# Altium project hv-distribution-board.PrjPcb
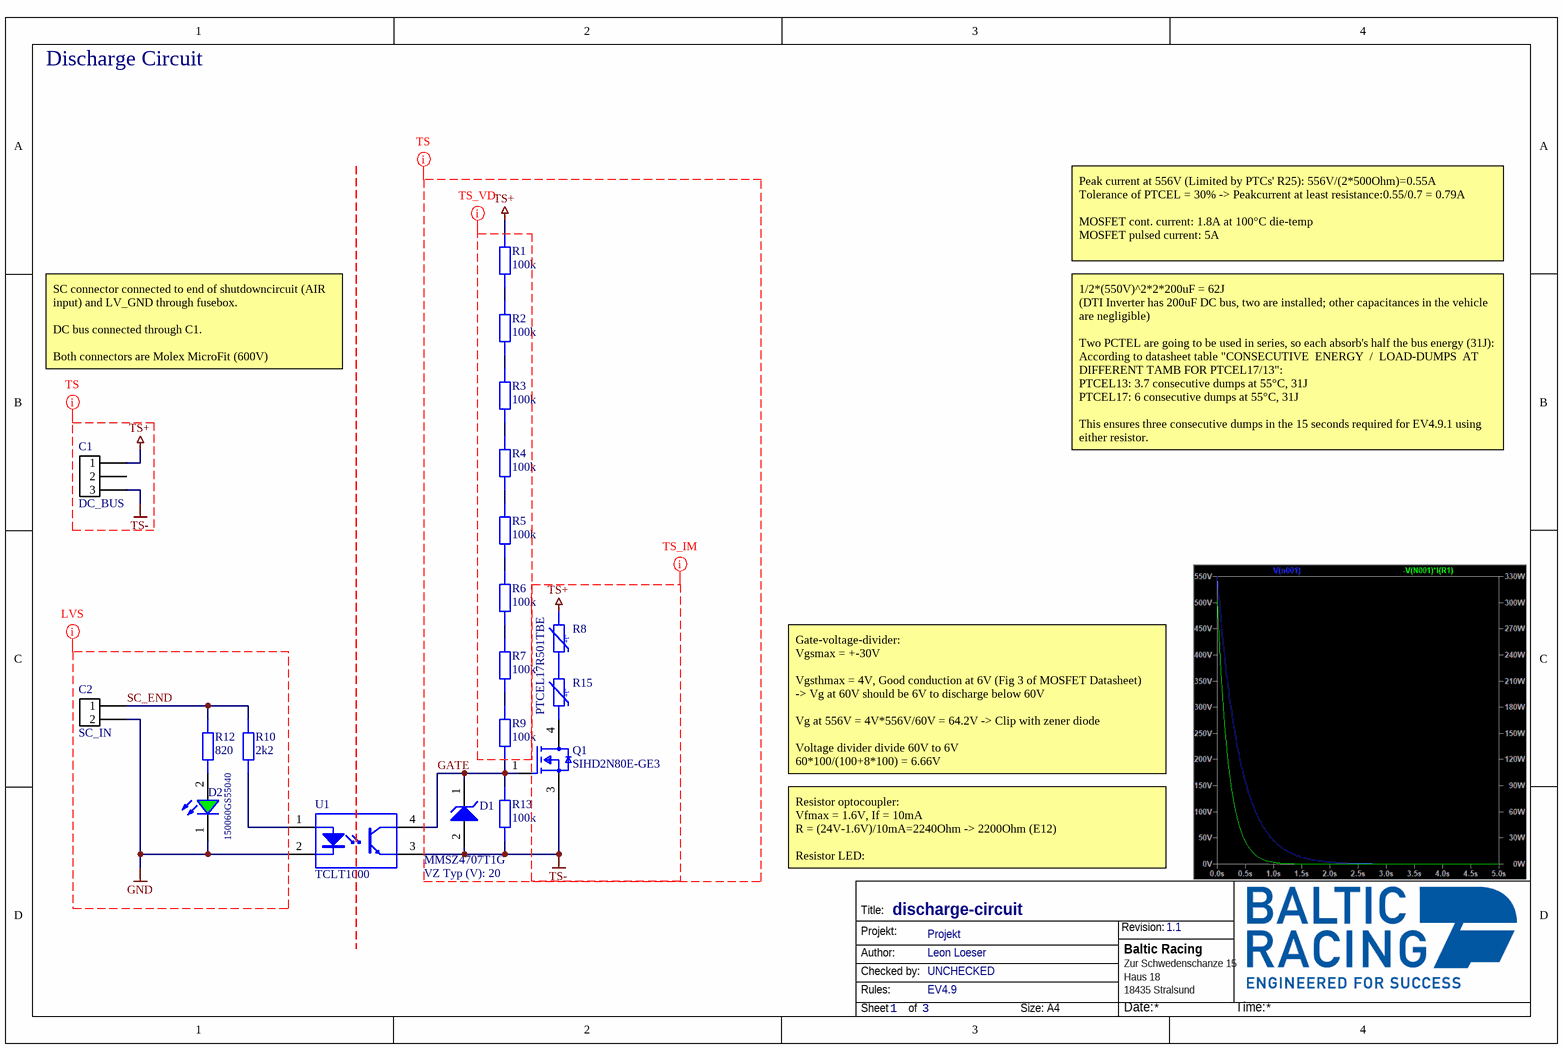
[diagram p0: discharge-circuit.SchDoc]
BoardName: hv-distribution-board; BoardRevision: 1.1; Organization: Baltic Racing
3 sheets, 28 parts. Net scope: global (net labels, ports and power ports of the same name join across sheets).
Board file: hv-distribution-board.PcbDoc
Sheets:
  discharge-circuit.SchDoc
  voltage-detection.SchDoc
  tsmp-resistors.SchDoc

## Sheet discharge-circuit.SchDoc: discharge-circuit
size A4; Date: 05.10.2017; CheckedBy: UNCHECKED; Author: Leon Loeser; Organization: Baltic Racing; Address1: Zur Schwedenschanze 15; Address2: Haus 18; Address3: 18435 Stralsund; Revision: 1.1; SheetNumber: 1; SheetTotal: 3; Rules: EV4.9; ProjectName: Projekt

### Parts
C1  DC_BUS  [43650-0309]
C2  SC_IN  [43650-0200]
D1  MMSZ4707T1G  VZ Typ (V): 20  [ONSC-SOD-123-2-425-04_V]
D2  150060GS55040  [WL-SMCW_0603_H=0.7]
Q1  SIHD2N80E-GE3  [FP-T16-0236-MFG]
R1  value 100k  [STACKPOLE CSR1206]  (hidden comment: SMD Resistor)
R2  value 100k  [STACKPOLE CSR1206]  (hidden comment: SMD Resistor)
R3  value 100k  [STACKPOLE CSR1206]  (hidden comment: SMD Resistor)
R4  value 100k  [STACKPOLE CSR1206]  (hidden comment: SMD Resistor)
R5  value 100k  [STACKPOLE CSR1206]  (hidden comment: SMD Resistor)
R6  value 100k  [STACKPOLE CSR1206]  (hidden comment: SMD Resistor)
R7  value 100k  [STACKPOLE CSR1206]  (hidden comment: SMD Resistor)
R8  PTCEL17R501TBE  [PTCEL17]  (value not drawn)
R9  value 100k  [STACKPOLE CSR1206]  (hidden comment: SMD Resistor)
R10  value 2k2  [STACKPOLE CSR0603]  (hidden comment: SMD Resistor)
R12  value 820  [STACKPOLE CSR0603]  (hidden comment: SMD Resistor)
R13  value 100k  [STACKPOLE CSR0603]  (hidden comment: SMD Resistor)
R15  PTCEL17R501TBE  [PTCEL17]
U1  TCLT1000  [VISH-SOP4L-4_V]

### Nets
GND: C2.2 D2.1(K) U1.2(C)
TS+: C1.1 R1.2 R8.1
TS-: C1.3 D1.2(A) Q1.3(S) R13.1 U1.3(E)
GATE: D1.1(K) Q1.1(G) R9.1 R13.2 U1.4(C)
SC_END: C2.1 R10.1 R12.2
NetD2_2: D2.2(A) R12.1
NetQ1_4: Q1.4(D) R15.2
NetR1_1: R1.1 R2.2
NetR2_1: R2.1 R3.2
NetR3_1: R3.1 R4.2
NetR4_1: R4.1 R5.2
NetR5_1: R5.1 R6.2
NetR6_1: R6.1 R7.2
NetR7_1: R7.1 R9.2
NetR8_2: R8.2 R15.1
NetR10_2: R10.2 U1.1(A)

Not connected (* = marked no-connect by the designer): C1 2

### Layout directives
net class TS: GATE, TS+, TS-
net class GLVS: GND, SC_END
net class TS_IM: GATE, TS+, TS-
net class TS_VD: GATE, TS+, TS-

### Notes on the sheet
- Discharge Circuit
- Peak current at 556V (Limited by PTCs' R25): 556V/(2*500Ohm)=0.55A
  Tolerance of PTCEL = 30% -> Peakcurrent at least resistance:0.55/0.7 = 0.79A
  MOSFET cont. current: 1.8A at 100°C die-temp
  MOSFET pulsed current: 5A
- SC connector connected to end of shutdowncircuit (AIR input) and LV_GND through fusebox.
  DC bus connected through C1.
  Both connectors are Molex MicroFit (600V)
- 1/2*(550V)^2*2*200uF = 62J
  (DTI Inverter has 200uF DC bus, two are installed; other capacitances in the vehicle are negligible)
  Two PCTEL are going to be used in series, so each absorb's half the bus energy (31J):
  According to datasheet table "CONSECUTIVE  ENERGY  /  LOAD-DUMPS  AT DIFFERENT TAMB FOR PTCEL17/13":
  PTCEL13: 3.7 consecutive dumps at 55°C, 31J
  PTCEL17: 6 consecutive dumps at 55°C, 31J
  This ensures three consecutive dumps in the 15 seconds required for EV4.9.1 using either resistor.
- Gate-voltage-divider:
  Vgsmax = +-30V
  Vgsthmax = 4V, Good conduction at 6V (Fig 3 of MOSFET Datasheet)
  -> Vg at 60V should be 6V to discharge below 60V
  Vg at 556V = 4V*556V/60V = 64.2V -> Clip with zener diode
  Voltage divider divide 60V to 6V
  60*100/(100+8*100) = 6.66V
- Resistor optocoupler:
  Vfmax = 1.6V, If = 10mA
  R = (24V-1.6V)/10mA=2240Ohm -> 2200Ohm (E12)
  Resistor LED:
  Vfmax = 3.4V, If = 25mA
  R = (24V-3.4V)/25mA=832Ohm -> 820Ohm (E12)
- Title:
- Projekt:
- Revision:
- Author:
- Rules:
- Checked by:
- Sheet
- of
- Size:
- A4
- Date:
- Time:
- (in symbol PTCEL17R501TBE) +t°

### Library data of the parts
C1 = MicroFit3.0 3-Pin: Molex Micro-Fit 3.0 3-Pin / 600V / 8.5A
C2 = MicroFit3.0 2-Pin: Molex Micro-Fit 3.0 2-Pin / 600V / 8.5A
D1 = CMP-1060-00328-1: Zener Voltage Regulator, 500 mW, 2-Pin SOD-123, Pb-Free, Tape and Reel; Manufacturer: On Semiconductor; P Max (W): 0.5; ComponentLink2Description: Datasheet; ComponentLink1Description: Manufacturer URL; PackageReference: SOD-123-2-425-04; PackageVersion: Rev. G, 10/2009; DatasheetVersion: Rev. 9; ComponentLink3URL: http://www.onsemi.com/pub_link/Collateral/425-04.PDF; ComponentLink2URL: http://www.onsemi.com/pub_link/Collateral/MMSZ4678T1-D.PDF; PackageDescription: 2-Pin SOD, Body 1.6 x 2.69 mm; Mounting Technology: Surface Mount; Packing: Tape and Reel; ComponentLink1URL: http://www.onsemi.com/; PartNumber: MMSZ4707T1G; ComponentLink3Description: Package Specification; RoHS: Pb-Free
D2 = 150060GS75000: SMT Mono-color Chip LED Waterclear WL-SMCW, size 0603, Green, 3.2 V, 140 deg, 430 mcd; Forward Voltage: 3.2 V; Viewing Angle: 140 deg; Peak Wavelength: 515 nm; Dominant Wavelength: 525 nm; Luminous Intensity: 430 mcd; Chip Technology: InGaN; ComponentLink1Description: Manufacturer; ComponentLink1URL: http://www.we-online.de; ComponentLink2Description: Datasheet; ComponentLink2URL: https://katalog.we-online.de/led/datasheet/150060GS75000.pdf; Part Number: 150060GS75000; Published Date: November 2018; Publisher: Wurth Elektronik; Size: 0603; Operating Temperature: -40 to 85 degC; Emitting Color: Green; Mounting Technology: SMT; Packaging: Tape and Reel
Q1 = CMP-02550-000080-1: MOSFET N-CH 800V 2.8A DPAK; Manufacturer: Vishay; Drain To Source Resistance: 2.38Ω; Reverse Recovery Time: 278ns; Power Dissipation: 62.5W; Reverse Recovery Charge: 900nC; Input Capacitace At Vds: 315pF @ 100V; Number Of Channels: 1; Turn On Delay Time: 11ns; Threshold Vgs Max: 4V; Threshold Vgs Min: 2V; Rthja Max: 62°C/W; Turn Off Delay Time: 19ns; Transconductance: 1S; Depletion Mode: False; Gate Charge At Vgs: 9.8nC @ 10V; Max Forward Diode Voltage: 1.2V; Gate To Source Voltage: 30V; Max Junction Temp: +150°C; Pulse Drain Current: 5A; Drain To Source Voltage: 800V; Lead Free: Yes; Continuous Drain Current: 2.8A; Category: Trans; Temperature Range Low: -55°C; Octopart: https://octopart.com/sihd2n80e-ge3-vishay-84840963; Device Class L3: MOSFETs; Manufacturer Part Number: SIHD2N80E-GE3; Footprint Url: https://www.vishay.com/docs/72594/72594.pdf; ComponentLink2URL: https://www.vishay.com/docs/91987/sihd2n80e.pdf; Device Class L1: Discrete Semiconductors; ComponentLink2Description: Datasheet; Digikey Description: MOSFET N-CH 800V 2.8A DPAK; Temperature: -55°C to +150°C; Device Class L2: Transistors; Number Of N Channels: 1; Height: 2.507mm; Drain To Source Breakdown Voltage: 800V; Automotive: No; RoHS: TRUE; Temperature Range High: +150°C; Package: T16-0236
R1-R7 R9 R10 R12 R13 = SMD Resistor: Resistor with multiple footprints
R8 R15 = PTCEL17R501TBE: PTCEL Series 1000 V 500 Ohm ±30 % Radial Inrush Current Limiter PTC Thermistor; Manufacturer: Vishay BCcomponents; Tolerance: 30%; Supplier 1: Mouser; Manufacturer Part Number: PTCEL17R501TBE; RoHS: No; Stock 1: 130; Pricing 1: 1=3,37000, 5=3,30000, 10=3,15000, 25=3,00000, 50=2,70000, 100=2,55000, 200=2,46000, 500=2,25000, 1000=2,17000, 10000=2,17000 (USD); RoHS Compliant: No; ComponentLink1URL: http://www.vishay.com/docs/29165/ptcel.pdf?src-supplier=Digi-Key; ComponentLink1Description: http://www.vishay.com/docs/29165/ptcel.pdf?src-supplier=Digi-Key; Supplier Part Number 1: 594-PTCEL17R501TBE
U1 = CMP-2000-07234-1: Optocoupler, Phototransistor Output, VCEO 70 V, -55 to 100 degC, 4-Pin SOP (SOP4L), RoHS, Tape and Reel; Manufacturer: Vishay/Semiconductor; Maximum Collector Emitter Voltage: 70V; Input Type: DC; Maximum Reverse Voltage: 6V; Maximum Collector Emitter Saturation Voltage: 300mV; Number of Channels per Chip: 1; Maximum Collector Current: 50mA; Maximum Power Dissipation: 250mW; Maximum Forward Voltage: 1.6V; Maximum Input Current: 60mA; Typical Forward Voltage: 1.25V; Minimum Isolation Voltage: 5000Vrms; Maximum Current Transfer Ratio @ Current: 600%; Manufacturer URL: http://www.vishay.com/; Package: 4SOP; Mounting Technology: SurfaceMount; Category: TransistorandPhotovoltaicOutputPhotoCouplers; Datasheet URL: http://www.vishay.com/docs/83515/tclt1000.pdf; Output Type: DC; Operating Temperature: -40to100°C; Package Description: 4-Pin Small Outline Package Integrated Circuit, Body 4.1 x 7.5 mm, Pitch 2.54 mm; Datasheet Version: Rev. 2.9, 12/2015; Package Reference: SOP4L; Packaging: Tape&Reel

## Sheet voltage-detection.SchDoc: voltage-detection
size A4; CheckedBy: Nico Bieberich; Author: Leon Loeser; Organization: Baltic Racing; Address1: Zur Schwedenschanze 15; Address2: Haus 18; Address3: 18435 Stralsund; Revision: 1.1; SheetNumber: 2; SheetTotal: 3; Rules: EV4.10.2; ProjectName: Projekt
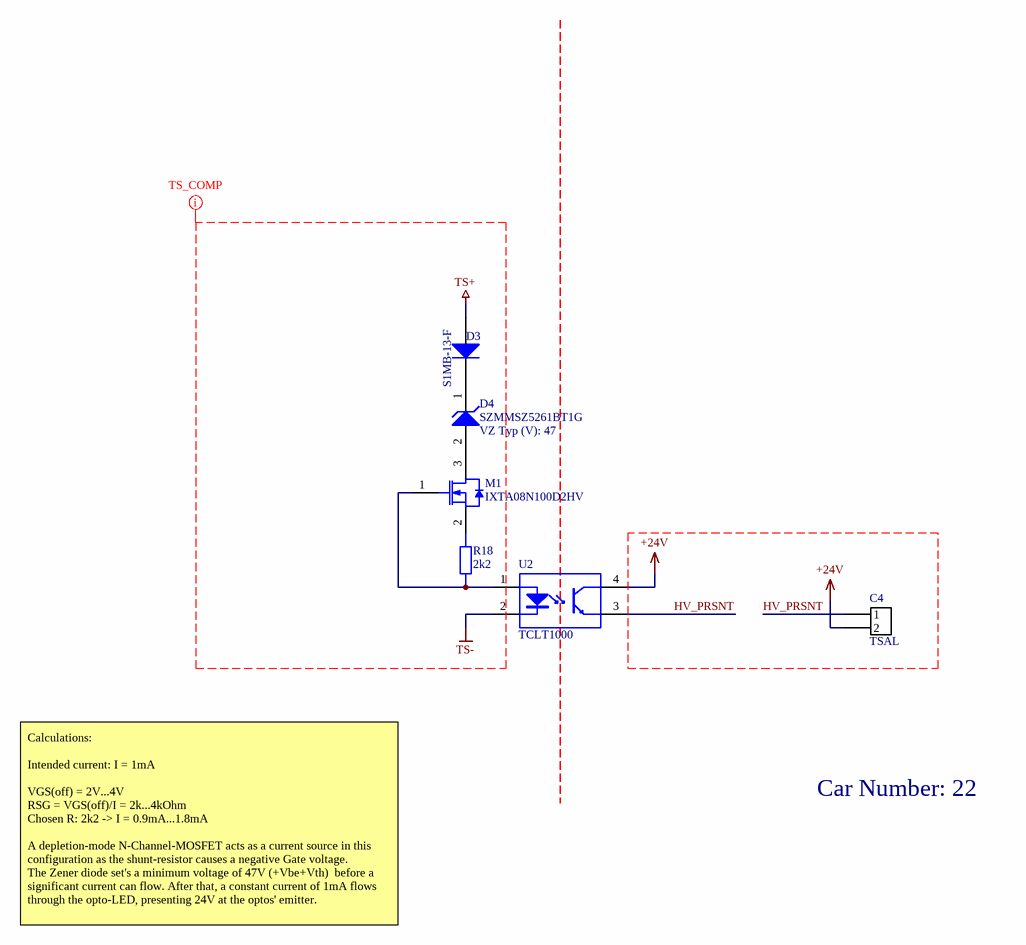
[diagram p1: voltage-detection.SchDoc]

### Parts
C4  TSAL  [43650-0200]
D3  S1MB-13-F  [DIOD-SMB-2_V]
D4  SZMMSZ5261BT1G  VZ Typ (V): 47  [ONSC-SOD-123-2-425-04_V]
M1  IXTA08N100D2HV  [IXYS_TO-263HV]
R18  value 2k2  [STACKPOLE CSR0603]  (hidden comment: SMD Resistor)
U2  TCLT1000  [VISH-SOP4L-4_V]

### Nets
+24V: C4.2 U2.4(C)
TS+: D3.1(A)
TS-: U2.2(C)
HV_PRSNT: C4.1 U2.3(E)
NetD3_2: D3.2(K) D4.1(K)
NetD4_2: D4.2(A) M1.3(DRAIN)
NetM1_1: M1.1(GATE) R18.1 U2.1(A)
NetM1_2: M1.2(SOURCE) R18.2

### Layout directives
net class TS_COMP: TS+, TS-

### Notes on the sheet
- Car Number: 22
- Calculations:
  Intended current: I = 1mA
  VGS(off) = 2V...4V
  RSG = VGS(off)/I = 2k...4kOhm
  Chosen R: 2k2 -> I = 0.9mA...1.8mA
  A depletion-mode N-Channel-MOSFET acts as a current source in this configuration as the shunt-resistor causes a negative Gate voltage.
  The Zener diode set's a minimum voltage of 47V (+Vbe+Vth)  before a significant current can flow. After that, a constant current of 1mA flows through the opto-LED, presenting 24V at the optos' emitter.
- Title:
- Projekt:
- Revision:
- Author:
- Rules:
- Checked by:
- Sheet
- of
- Size:
- A4
- Date:
- Time:

### Library data of the parts
C4 = MicroFit3.0 2-Pin: Molex Micro-Fit 3.0 2-Pin / 600V / 8.5A
D3 = CMP-2000-07013-1: Surface Mount Glass Passivated Rectifier / , 1 A, 1.1 V, -65 to 150 degC, 2-Pin SMD, RoHS, Tape and Reel; Manufacturer: Diodes Inc; Average Rectified Current-Max: 1A; Forward Voltage: 1.1V; Reverse Current-Max: 5µA; Peak Current-Max: 30A; Reverse Voltage-Max [Vrrm]: 1000V; Manufacturer URL: http://www.diodes.com/; Datasheet URL: http://www.diodes.com/_files/datasheets/ds16003.pdf; Datasheet Version: Rev. 24-2, 12/2014; Package Description: 2-Pin Surface Mount Device, Body 4.315 x 3.62 mm; Package Reference: SMB-2; Mounting Technology: SurfaceMount
D4 = CMP-1060-00394-1: Zener Voltage Regulator, 500 mW, 2-Pin SOD-123, Pb-Free, Tape and Reel; Manufacturer: On Semiconductor; P Max (W): 0.5; ComponentLink3Description: Package Specification; PartNumber: SZMMSZ5261BT1G; ComponentLink1Description: Manufacturer URL; ComponentLink2Description: Datasheet; Mounting Technology: Surface Mount; ComponentLink2URL: http://www.onsemi.cn/pub_link/Collateral/MMSZ5221BT1-D.PDF; Packing: Tape and Reel; PackageVersion: Rev. G, 10/2009; RoHS: Pb-Free; ComponentLink1URL: http://www.onsemi.com/; PackageReference: SOD-123-2-425-04; PackageDescription: 2-Pin SOD, Body 1.6 x 2.69 mm; ComponentLink3URL: http://www.onsemi.com/pub_link/Collateral/425-04.PDF; DatasheetVersion: Rev. 12
M1 = IXTA08N100D2HV: D2 Series - 100V - 1700V N-Channel Depletion Mode Power MOSFETs, TO-263HV, RoHS; Manufacturer: Littelfuse; Supplier 1: Arrow Electronics; Manufacturer Part Number: IXTA08N100D2HV; RoHS: Yes; Category: MOSFETs; Stock 1: 30; Pricing 1: 1=1,74230, 300=2,14500, 500=1,90100, 1000=1,67700, 2000=1,66000, 2500=1,64400, 3000=1,62700, 4000=1,61100, 5000=1,59500, 10000=1,57900, 20000=1,56300 (USD); Supplier Part Number 1: IXTA08N100D2HV
R18 = SMD Resistor: Resistor with multiple footprints
U2 = CMP-2000-07234-1: as U1 on sheet discharge-circuit; Manufacturer URL: http://www.vishay.com/; Package: 4SOP; Mounting Technology: SurfaceMount; Category: TransistorandPhotovoltaicOutputPhotoCouplers; Datasheet URL: http://www.vishay.com/docs/83515/tclt1000.pdf; Output Type: DC; Operating Temperature: -40to100°C; Package Description: 4-Pin Small Outline Package Integrated Circuit, Body 4.1 x 7.5 mm, Pitch 2.54 mm; Datasheet Version: Rev. 2.9, 12/2015; Package Reference: SOP4L; Packaging: Tape&Reel

## Sheet tsmp-resistors.SchDoc: tsmp-resistors
size A4; Date: 05.10.2017; CheckedBy: UNCHECKED; Author: Leon Loeser; Organization: Baltic Racing; Address1: Zur Schwedenschanze 15; Address2: Haus 18; Address3: 18435 Stralsund; Revision: 1.0; SheetNumber: 3; SheetTotal: 3; Rules: EV4.7.6; ProjectName: Projekt
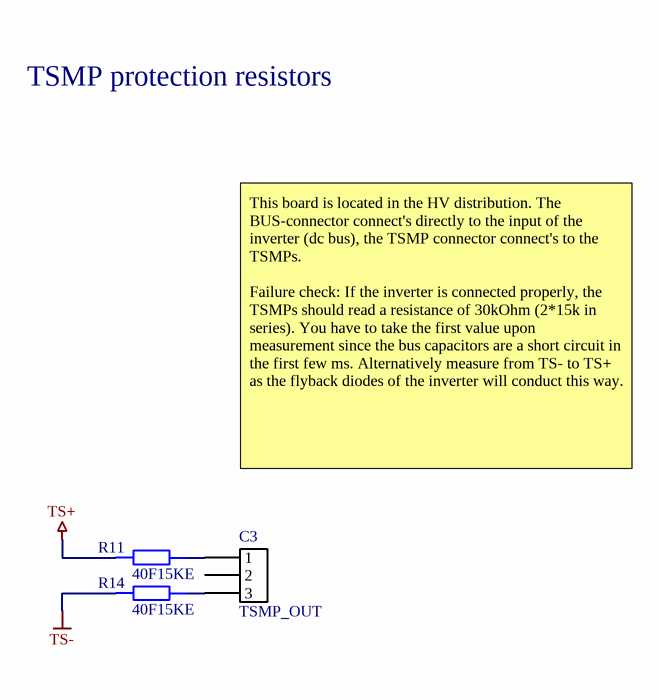
[diagram p2: tsmp-resistors.SchDoc]

### Parts
C3  TSMP_OUT  [43650-0309]
R11  40F15KE  [OHMITE_40_SERIES]
R14  40F15KE  [OHMITE_40_SERIES]

### Nets
TS+: R11.1
TS-: R14.1
NetC3_1: C3.1 R11.2
NetC3_3: C3.3 R14.2

Not connected (* = marked no-connect by the designer): C3 2

### Notes on the sheet
- TSMP protection resistors
- This board is located in the HV distribution. The BUS-connector connect's directly to the input of the inverter (dc bus), the TSMP connector connect's to the TSMPs.
  Failure check: If the inverter is connected properly, the TSMPs should read a resistance of 30kOhm (2*15k in series). You have to take the first value upon measurement since the bus capacitors are a short circuit in the first few ms. Alternatively measure from TS- to TS+ as the flyback diodes of the inverter will conduct this way.
- Title:
- Projekt:
- Revision:
- Author:
- Rules:
- Checked by:
- Sheet
- of
- Size:
- A4
- Date:
- Time:

### Library data of the parts
C3 = MicroFit3.0 3-Pin: Molex Micro-Fit 3.0 3-Pin / 600V / 8.5A
R11 R14 = 40F15KE: Wirewound Resistors 10watt 15K 1% Axial; Manufacturer: Ohmite; Power Rating: 10W; Temperature Coefficient: 20ppm/°C; Supplier 1: Mouser; Manufacturer Part Number: 40F15KE; RoHS: Yes; Category: Through-Hole Resistors; Stock 1: 619; Pricing 1: 1=2,89000, 10=2,61000, 50=2,14000, 100=2,06000, 1000=1,35000, 10000=1,32000 (USD); Mount: Through Hole; Case/Package: Axial; Tolerance: 1%; Resistance: 15k; Packaging: Bulk; Package Quantity: 25; Resistor Type: Wirewound; Number of Terminations: 2; Termination: Axial; Max Power Dissipation: 10W; Series: Ohmicone® 40; Length: 1.902inch; RoHS Compliant: Yes; Supplier Part Number 1: 588-40F15KE; ComponentLink4Description: Datasheet; ComponentLink4URL: https://www.ohmite.com/assets/docs/res_40.pdf; ComponentLink5Description: Product Page; ComponentLink5URL: https://www.ohmite.com/40-series

## Nets that join several sheets
TS+: discharge-circuit (C1.1 R1.2 R8.1), voltage-detection (D3.1), tsmp-resistors (R11.1)
TS-: discharge-circuit (5 pins), voltage-detection (U2.2), tsmp-resistors (R14.1)

## Assembly variants
Bestückung 2022 Chipkrise: alternate parts R15 -> PTCEL13R501RBE, R8 -> PTCEL13R501RBE